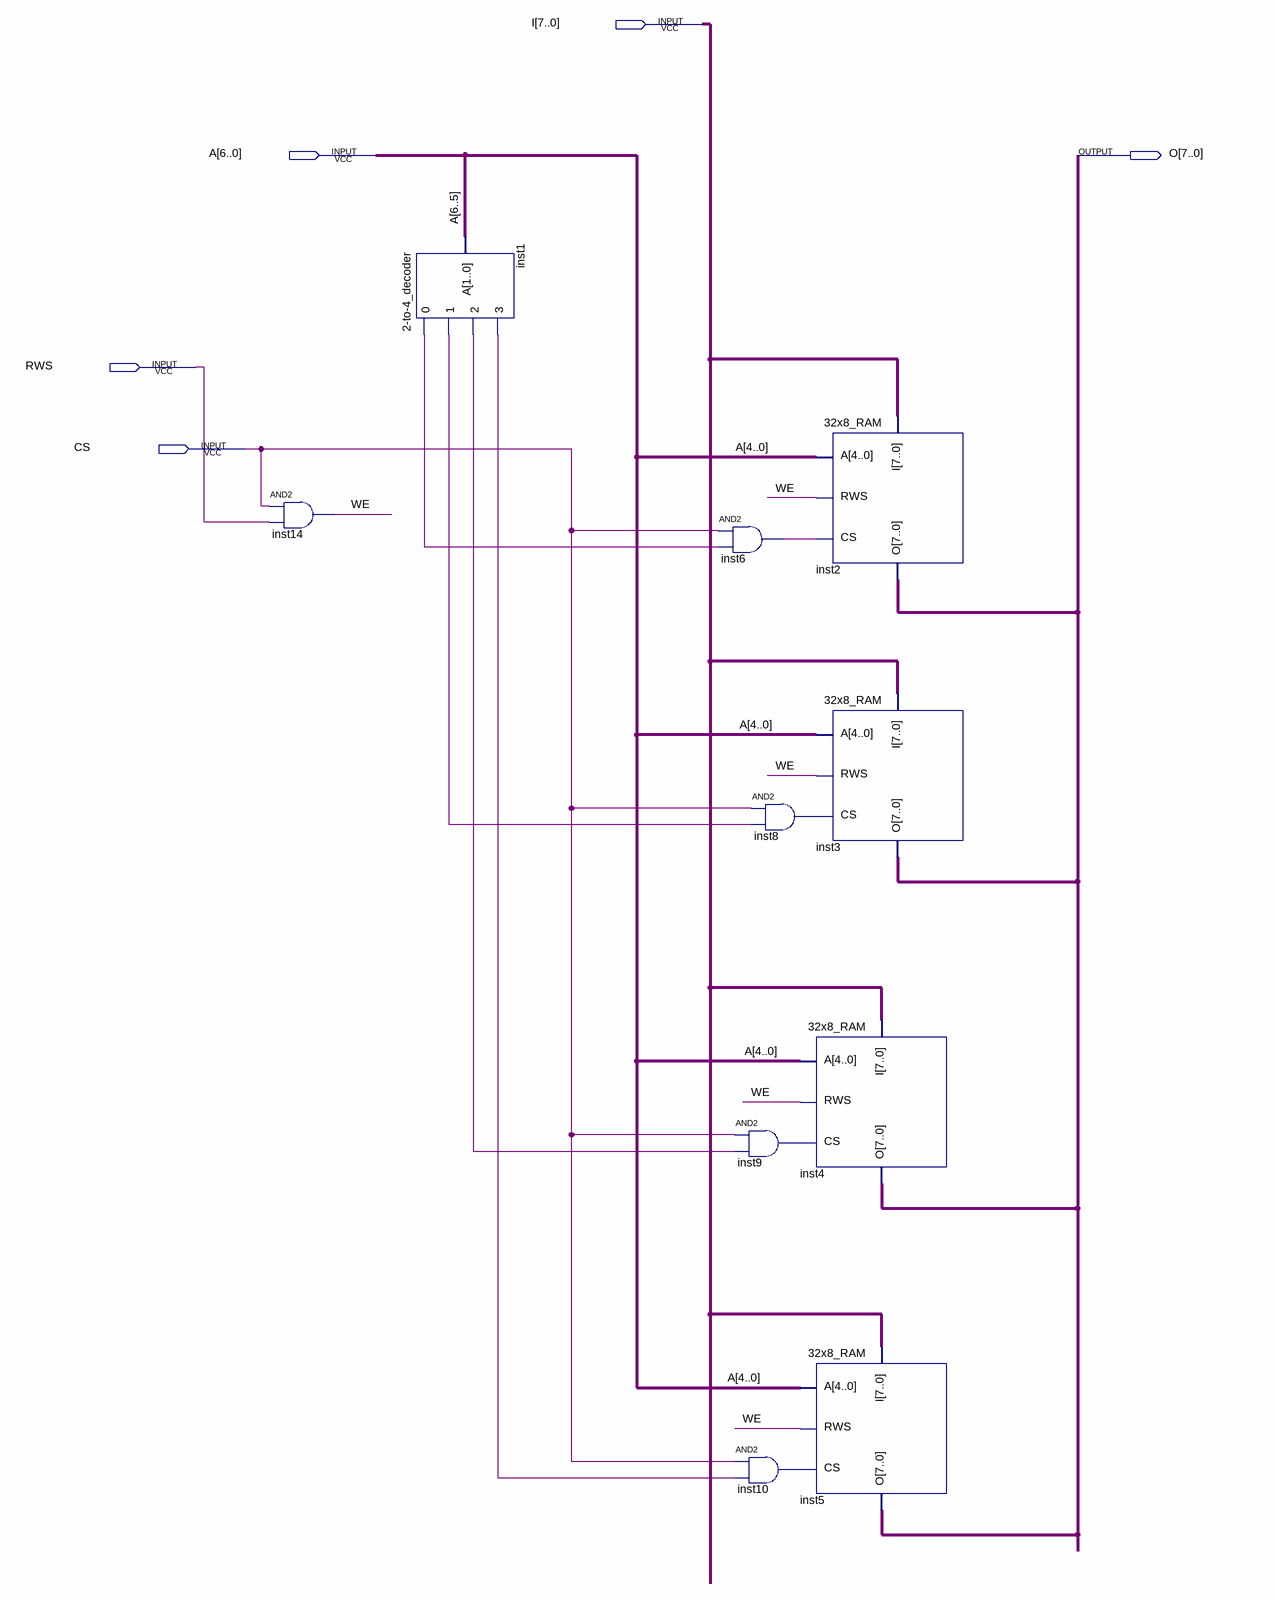
[diagram p0: schematic sheet]
// Quartus schematic 128x8_RAM.bdf as structural Verilog: 10 symbols, 5 pins
module \128x8_RAM  (
  input  [7:0] I,
  input  [6:0] A,
  input  RWS,
  input  CS,
  output [7:0] O
);

  wire inst1_0, inst1_1, inst1_2, inst1_3, inst6_out, inst8_out, inst9_out, inst10_out, WE;

  and inst14 (WE, CS, RWS);
  \2-to-4_decoder  inst1 (.A(A[6:5]), .\0 (inst1_0), .\1 (inst1_1), .\2 (inst1_2), .\3 (inst1_3));
  and inst6 (inst6_out, CS, inst1_0);
  and inst9 (inst9_out, CS, inst1_2);
  and inst10 (inst10_out, CS, inst1_3);
  and inst8 (inst8_out, CS, inst1_1);
  \32x8_RAM  inst4 (.I(I), .A(A[4:0]), .RWS(WE), .CS(inst9_out), .O(O));
  \32x8_RAM  inst5 (.I(I), .A(A[4:0]), .RWS(WE), .CS(inst10_out), .O(O));
  \32x8_RAM  inst2 (.I(I), .A(A[4:0]), .RWS(WE), .CS(inst6_out), .O(O));
  \32x8_RAM  inst3 (.I(I), .A(A[4:0]), .RWS(WE), .CS(inst8_out), .O(O));
endmodule
